# EAGLE schematic BAIT MicroMod Carrier Board (EAGLE 9.6.2)
Assembly variants: LoRa

## Sheet 1 of 2
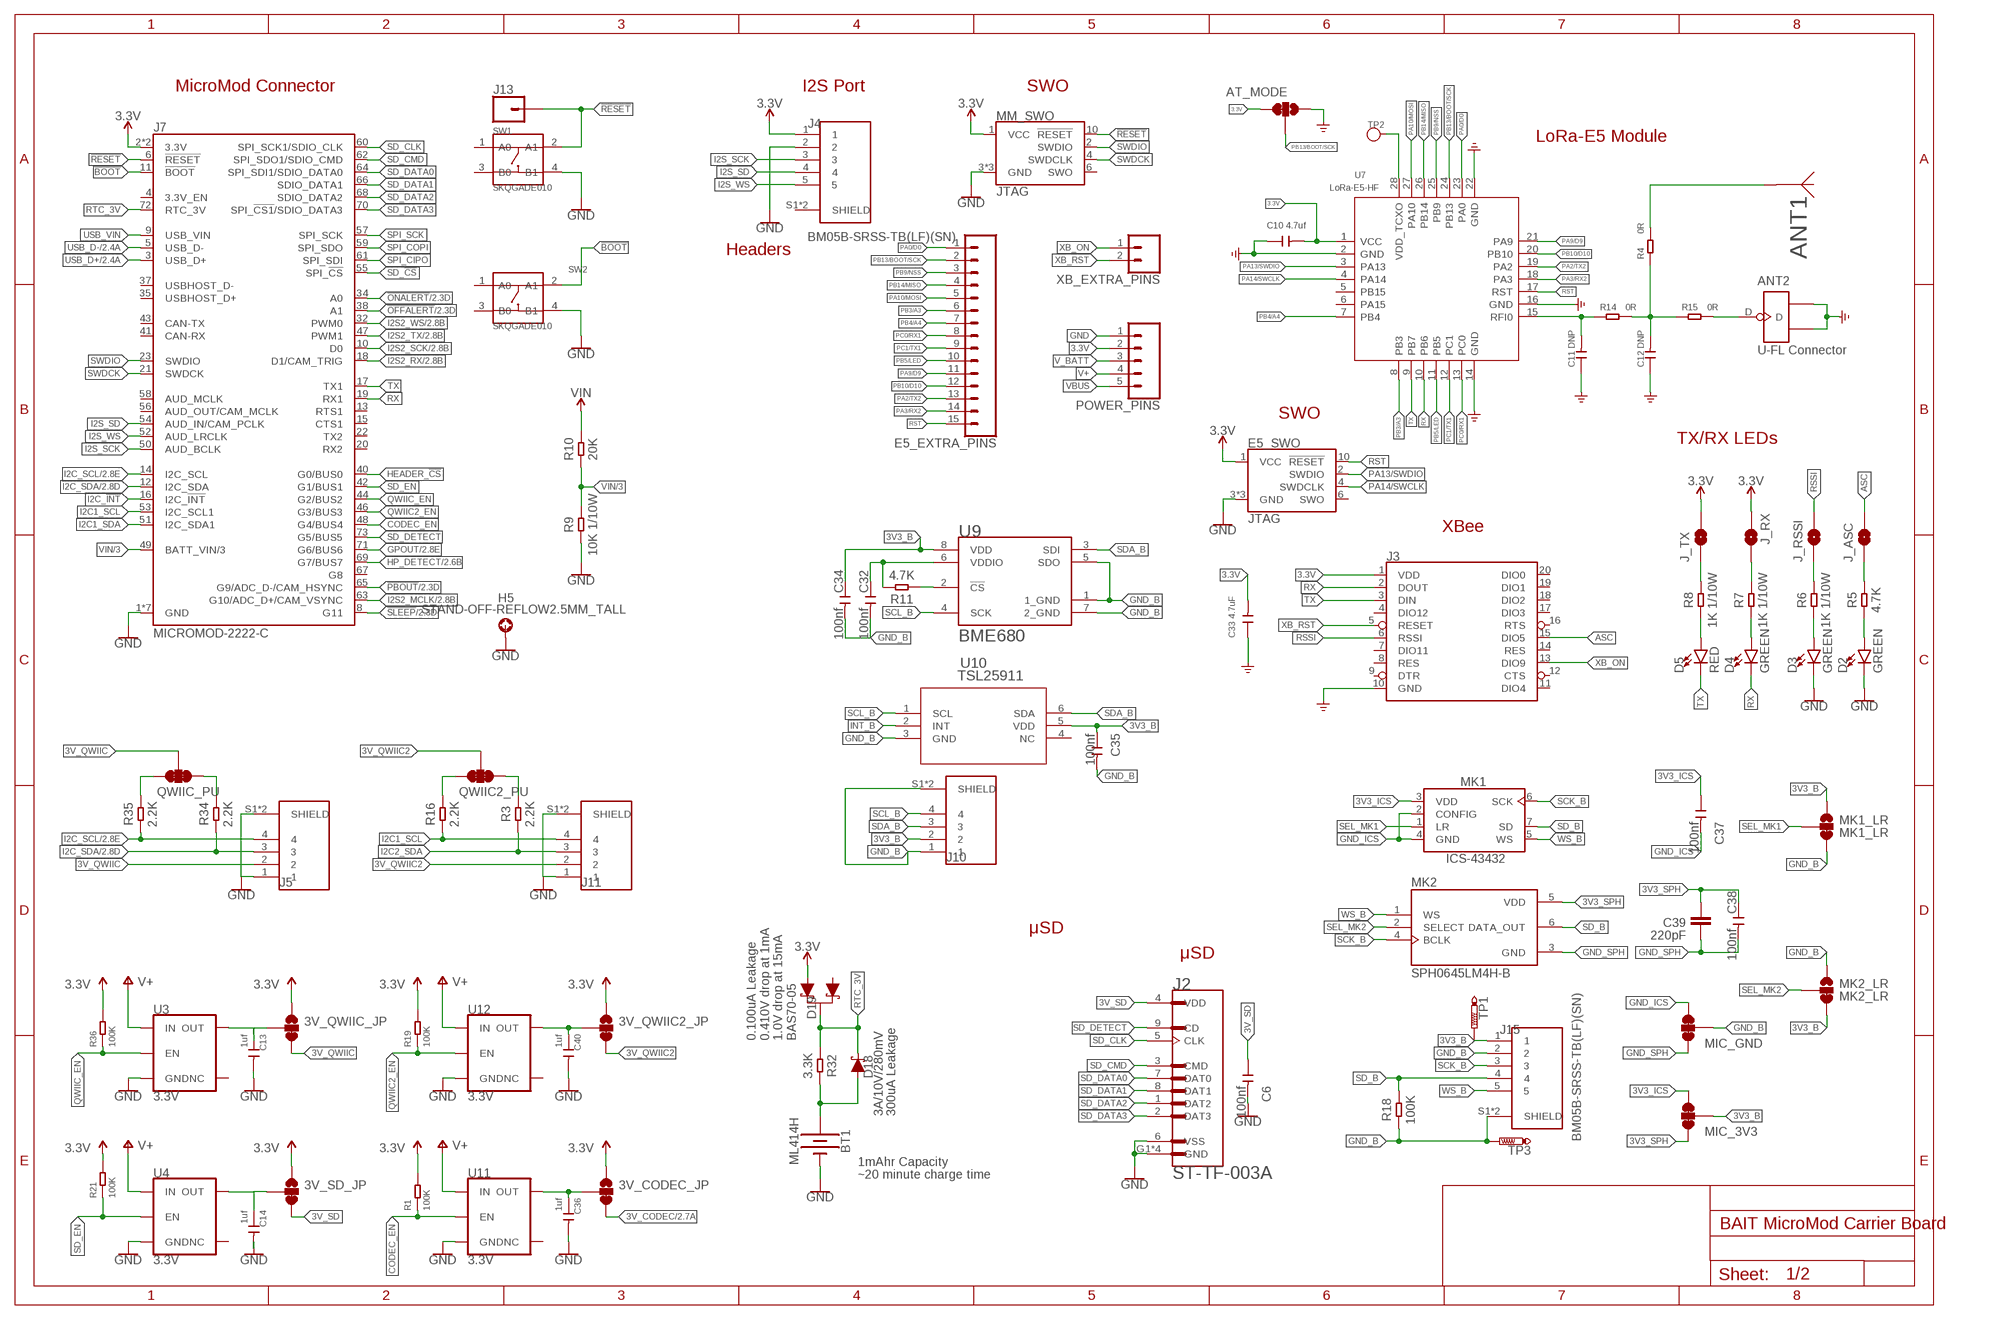
[diagram p0: schematic, sheet 1]

### Parts
3V_CODEC_JP  MK2_LR  JUMPER-SMT_3_1-NC_TRACE_SILK  [SMT-JUMPER_3_1-NC_TRACE_SILK]
3V_QWIIC2_JP  MK2_LR  JUMPER-SMT_3_1-NC_TRACE_SILK  [SMT-JUMPER_3_1-NC_TRACE_SILK]
3V_QWIIC_JP  MK2_LR  JUMPER-SMT_3_1-NC_TRACE_SILK  [SMT-JUMPER_3_1-NC_TRACE_SILK]
3V_SD_JP  MK2_LR  JUMPER-SMT_3_1-NC_TRACE_SILK  [SMT-JUMPER_3_1-NC_TRACE_SILK]
ANT1  0868AT43A0020EANT_0868AT43A0020E_JOT  [ANT_0868AT43A0020E_JOT]
ANT2  U-FL Connector  ANTENNA-U-FL-320110048  [U-FL3P-SMD-2.6X2.6X1.0MM]
AT_MODE  MK2_LR  JUMPER-SMT_3_1-NC_TRACE_SILK  [SMT-JUMPER_3_1-NC_TRACE_SILK]
BT1  ML414H  ML414H_IV01E_BATTERY  [ML414H_IV01E]
C6  100nf  CERAMIC-100NF-50V-10%-X7R(0603)  [C0603]
C10  4.7uf  CERAMIC-4.7UF-10V-10%-X5R(0603)  [C0603]
C11  DNP  CAP-0402  [C0402]
C12  DNP  CAP-0402  [C0402]
C13  1uf  CERAMIC-1UF-25V-10%-X7R(0603)  [C0603]
C14  1uf  CERAMIC-1UF-25V-10%-X7R(0603)  [C0603]
C32  100nf  CERAMIC-100NF-50V-10%-X7R(0603)  [C0603]
C33  4.7uF  CAP-0603  [C0603]
C34  100nf  CERAMIC-100NF-50V-10%-X7R(0603)  [C0603]
C35  100nf  CERAMIC-100NF-50V-10%-X7R(0603)  [C0603]
C36  1uf  CERAMIC-1UF-25V-10%-X7R(0603)  [C0603]
C37  100nf  CERAMIC-100NF-50V-10%-X7R(0603)  [C0603]
C38  100nf  CERAMIC-100NF-50V-10%-X7R(0603)  [C0603]
C39  220pF  C_CHIP-0603(1608-METRIC)  [CAPC1608X85]
C40  1uf  CERAMIC-1UF-25V-10%-X7R(0603)  [C0603]
D2  GREEN  LED-GREEN0603  [LED-0603]  (not fitted in variant LoRa)
D3  GREEN  LED-GREEN0603  [LED-0603]  (not fitted in variant LoRa)
D4  GREEN  LED-GREEN0603  [LED-0603]
D5  RED  LED-RED0603  [LED-0603]
D18  3A/10V/280mV  DIODE-SCHOTTKY-BAT60A  [SOD-323]
D19  BAS70-05  DIODE-SCHOTTKY-DUAL  [SOT23-3]
E5_EXTRA_PINS  CONN_15  [1X15]
E5_SWO  JTAG  CORTEX_JTAG_DEBUG_MINIMUM_PTH  [2X5-PTH-1.27MM]
H5  STAND-OFF-REFLOW2.5MM_TALL  [STAND-OFF-REFLOW-M2.5]
J2  ST-TF-003A  [SUNTECH_ST-TF-003A]
J3  XBEESMD  [XBEE-SMD]
J4  BM05B-SRSS-TB(LF)(SN)  [JST_BM05B-SRSS-TB(LF)(SN)]
J5  QWIIC_RIGHT_ANGLE  BM04B-SRSS-TB(LF)(SN)  [JST_BM04B-SRSS-TB(LF)(SN)]
J7  MICROMOD-2222-C  [M.2-CONNECTOR-E]
J10  QWIIC_RIGHT_ANGLE  BM04B-SRSS-TB(LF)(SN)  [JST_BM04B-SRSS-TB(LF)(SN)]
J11  QWIIC_RIGHT_ANGLE  BM04B-SRSS-TB(LF)(SN)  [JST_BM04B-SRSS-TB(LF)(SN)]
J13  CONN_01PTH_NO_SILK_YES_STOP  [1X01_NO_SILK]
J15  BM05B-SRSS-TB(LF)(SN)  [JST_BM05B-SRSS-TB(LF)(SN)]
J_ASC  JUMPER-SMT_2_NO_SILK  [SMT-JUMPER_2_NO_SILK]
J_RSSI  JUMPER-SMT_2_NO_SILK  [SMT-JUMPER_2_NO_SILK]
J_RX  JUMPER-SMT_2_NO_SILK  [SMT-JUMPER_2_NO_SILK]
J_TX  JUMPER-SMT_2_NO_SILK  [SMT-JUMPER_2_NO_SILK]
MIC_3V3  JUMPER-SMT_3_2-NC_TRACE_SILK  [SMT-JUMPER_3_2-NC_TRACE_SILK]
MIC_GND  JUMPER-SMT_3_2-NC_TRACE_SILK  [SMT-JUMPER_3_2-NC_TRACE_SILK]
MK1  ICS-43432  [ICS-43432]
MK1_LR  MK1_LR  JUMPER-SMT_3_1-NC_TRACE_SILK  [SMT-JUMPER_3_1-NC_TRACE_SILK]
MK2  SPH0645LM4H-B  [MIC_SPH0645LM4H-B]
MK2_LR  MK2_LR  JUMPER-SMT_3_1-NC_TRACE_SILK  [SMT-JUMPER_3_1-NC_TRACE_SILK]
MM_SWO  JTAG  CORTEX_JTAG_DEBUG_MINIMUM_PTH  [2X5-PTH-1.27MM]
POWER_PINS  CONN_05  [1X05]
QWIIC2_PU  JUMPER-SMT_3_2-NC_TRACE_SILK  [SMT-JUMPER_3_2-NC_TRACE_SILK]
QWIIC_PU  JUMPER-SMT_3_2-NC_TRACE_SILK  [SMT-JUMPER_3_2-NC_TRACE_SILK]
R1  100K  SMD-RES-100K-1%-1/10W(0603)  [R0603]
R3  2.2K  SMD-RES-2.2K-5%-1/10W(0603)  [R0603]
R4  0R  SMD-RES-0R-5%-1/10W(0603)  [R0603]
R5  4.7K  SMD-RES-4.7K-5%-1/10W(0603)  [R0603]  (not fitted in variant LoRa)
R6  1K 1/10W  SMD-RES-1K-5%-1/10W(0603)  [R0603]  (not fitted in variant LoRa)
R7  1K 1/10W  SMD-RES-1K-5%-1/10W(0603)  [R0603]
R8  1K 1/10W  SMD-RES-1K-5%-1/10W(0603)  [R0603]
R9  10K 1/10W  SMD-RES-10K-5%-1/10W(0603)  [R0603]
R10  20K  SMD-RES-20K-1%-1/10W(0603)  [R0603]
R11  4.7K  SMD-RES-4.7K-5%-1/10W(0603)  [R0603]
R14  0R  SMD-RES-0R-5%-1/10W(0603)  [R0603]
R15  0R  SMD-RES-0R-5%-1/10W(0603)  [R0603]
R16  2.2K  SMD-RES-2.2K-5%-1/10W(0603)  [R0603]
R18  100K  SMD-RES-100K-1%-1/10W(0603)  [R0603]
R19  100K  SMD-RES-100K-1%-1/10W(0603)  [R0603]
R21  100K  SMD-RES-100K-1%-1/10W(0603)  [R0603]
R32  3.3K  SMD-RES-3.3K-1%-1/10W(0603)  [R0603]
R34  2.2K  SMD-RES-2.2K-5%-1/10W(0603)  [R0603]
R35  2.2K  SMD-RES-2.2K-5%-1/10W(0603)  [R0603]
R36  100K  SMD-RES-100K-1%-1/10W(0603)  [R0603]
SW1  SKQGADE010  SMD-BUTTON(4P-5.2X5.2X1.5MM-SKQGADE010)-SKQGADE010  [SW4-SMD-5.2X5.2X1.5MM]
SW2  SKQGADE010  SMD-BUTTON(4P-5.2X5.2X1.5MM-SKQGADE010)-SKQGADE010  [SW4-SMD-5.2X5.2X1.5MM]
TP1  PTR1TP06R  [TP06R]
TP2  TEST  TEST-POINT'4545'  [TP-D45MIL]
TP3  PTR1TP06R  [TP06R]
U3  3.3V  V_REG_AP2112K-3.3V  [SOT23-5]
U4  3.3V  V_REG_AP2112K-3.3V  [SOT23-5]
U7  LoRa-E5-HF  MOUDLE_LORA_E5  [MOUDLE28P-1.25-12X12X2.5MM]
U9  BOSCH_TOOLS_BME680BOSCH_TOOLS_BME680_0_0  [BOSCH_TOOLS_BME680_0]
U10  TSL25911  TSL25911FNSON-06-FN_2000X2400_AMS  [SON-06-FN_2000X2400_AMS]
U11  3.3V  V_REG_AP2112K-3.3V  [SOT23-5]
U12  3.3V  V_REG_AP2112K-3.3V  [SOT23-5]
XB_EXTRA_PINS  CONN_02  [1X02]

### Nets
3.3V [power]: 3V_CODEC_JP.1 3V_QWIIC2_JP.1 3V_QWIIC_JP.1 3V_SD_JP.1 AT_MODE.3 C10.2 C33.2 D19.2(A1) E5_SWO.1(VCC) J3.1(VDD) J4.1 J7.2(3.3V) J7.74(3.3V) J_RX.1 J_TX.2 MM_SWO.1(VCC) POWER_PINS.2 R1.2 R19.2 R21.2 R36.2 U7.1(VCC) ; also sheet 2
3V3_B: C34.1 C35.1 J10.2 J15.1 MIC_3V3.2 MK1_LR.1 MK2_LR.3 TP1.TP U9.8(VDD) U10.5(VDD)
3V3_ICS: C37.1 MIC_3V3.3 MK1.3(VDD)
3V3_SPH: C38.1 C39.1 MIC_3V3.1 MK2.5(VDD)
3V_CODEC [power]: 3V_CODEC_JP.3 ; also sheet 2
3V_QWIIC [power]: 3V_QWIIC_JP.3 J5.2 QWIIC_PU.2
3V_QWIIC2 [power]: 3V_QWIIC2_JP.3 J11.2 QWIIC2_PU.2
3V_QWIIC_OUT [power]: 3V_QWIIC_JP.2 C13.1
3V_QWIIC_OUT1 [power]: 3V_CODEC_JP.2 C36.1 U11.5(OUT)
3V_QWIIC_OUT2 [power]: 3V_QWIIC2_JP.2 C40.1 U12.5(OUT)
3V_SD [power]: 3V_SD_JP.3 C6.1 J2.4(VDD)
3V_SD_OUT [power]: 3V_SD_JP.2 C14.1 U4.5(OUT)
!BOOT!: J7.11(!BOOT!) SW2.2(A1)
!OFFALERT!: J7.38(A1) ; also sheet 2
!ONALERT!: J7.34(A0) ; also sheet 2
!PBOUT!: J7.65(G9/ADC_D-/CAM_HSYNC) ; also sheet 2
!RESET!: J7.6(!RESET!) J13.1 MM_SWO.10(!RESET) SW1.2(A1)
!SLEEP!: J7.8(G11) ; also sheet 2
ASC: J3.15(DIO5) J_ASC.2
CODEC_EN: J7.48(G4/BUS4) R1.1 U11.3(EN)
GND [power]: ANT2.GND1 ANT2.GND2 AT_MODE.1 BT1.- C6.2 C10.1 C11.1 C12.1 C13.2 C14.2 C33.1 C36.2 C40.2 D2.C D3.C E5_SWO.3(GND) E5_SWO.5(GND) E5_SWO.9(GND) H5.1 J2.6(VSS) J2.G1(GND) J2.G2(GND) J2.G3(GND) J2.G4(GND) J3.10(GND) J4.2 J5.1 J5.S1(SHIELD) J5.S2(SHIELD) J7.1(GND) J7.7(GND) J7.33(GND) J7.36(GND) J7.39(GND) J7.45(GND) J7.75(GND) J11.1 J11.S1(SHIELD) J11.S2(SHIELD) MM_SWO.3(GND) MM_SWO.5(GND) MM_SWO.9(GND) POWER_PINS.1 R9.1 SW1.4(B1) SW2.4(B1) U3.2(GND) U4.2(GND) U7.2(GND) U7.14(GND) U7.16(GND) U7.22(GND) U11.2(GND) U12.2(GND) ; supply symbol labelled GND_POWER ; also sheet 2
GND_B: C32.2 C34.2 C35.2 J10.1 J10.S1(SHIELD) J10.S2(SHIELD) J15.2 J15.S1(SHIELD) J15.S2(SHIELD) MIC_GND.2 MK1_LR.3 MK2_LR.1 R18.1 TP3.TP U9.1(1_GND) U9.5(SDO) U9.7(2_GND) U10.3(GND)
GND_ICS: C37.2 MIC_GND.3 MK1.2(CONFIG) MK1.4(GND)
GND_SPH: C38.2 C39.2 MIC_GND.1 MK2.3(GND)
GPOUT: J7.71(G6/BUS6) ; also sheet 2
HEADER_!CS!: J7.40(G0/BUS0)
HP_DETECT: J7.69(G7/BUS7) ; also sheet 2
I2C1_SCL: J7.53(I2C_SCL1) J11.4 R16.1
I2C1_SDA: J7.51(I2C_SDA1)
I2C2_SDA: J11.3 R3.1
I2C_!INT!: J7.16(I2C_!INT!)
I2C_SCL [com]: J5.4 J7.14(I2C_SCL) R35.1 ; also sheet 2
I2C_SDA [com]: J5.3 J7.12(I2C_SDA) R34.1 ; also sheet 2
I2S2_MCLK: J7.63(G10/ADC_D+/CAM_VSYNC) ; also sheet 2
I2S2_RX: J7.18(D1/CAM_TRIG) ; also sheet 2
I2S2_SCK: J7.10(D0) ; also sheet 2
I2S2_TX: J7.47(PWM1) ; also sheet 2
I2S2_WS: J7.32(PWM0) ; also sheet 2
I2S_SCK: J4.3 J7.50(AUD_BCLK)
I2S_SD: J4.4 J7.54(AUD_IN/CAM_PCLK)
I2S_WS: J4.5 J7.52(AUD_LRCLK)
INT_B: U10.2(INT)
N$1: QWIIC2_PU.3 R16.2
N$2: QWIIC2_PU.1 R3.2
N$3: J_RX.2 R7.2
N$7 [impedence_ctl]: ANT2.D R15.2
N$9: D4.A R7.1
N$11 [impedence_ctl]: ANT1.1 R4.2
N$19: TP2.T U7.28(VDD_TCXO)
N$23: BT1.+ D18.A R32.1
N$24: QWIIC_PU.3 R35.2
N$25: J_ASC.1 R5.2
N$26: QWIIC_PU.1 R34.2
N$28 [impedence_ctl]: C12.2 R4.1 R14.2 R15.1
N$34: D2.A R5.1
N$42: J_RSSI.1 R6.2
N$43: D3.A R6.1
N$44: J_TX.1 R8.2
N$45: D5.A R8.1
N$54: C32.1 R11.2 U9.6(VDDIO)
N$55: R11.1 U9.2(!CS!)
N$77: U3.5(OUT)
PA0/D0: E5_EXTRA_PINS.1 U7.23(PA0)
PA2/TX2 [com]: E5_EXTRA_PINS.13 U7.19(PA2)
PA3/RX2 [com]: E5_EXTRA_PINS.14 U7.18(PA3)
PA9/D9: E5_EXTRA_PINS.11 U7.21(PA9)
PA10/MOSI [com]: E5_EXTRA_PINS.5 U7.27(PA10)
PA13/SWDIO: E5_SWO.2(SWDIO) U7.3(PA13)
PA14/SWCLK: E5_SWO.4(SWDCLK) U7.4(PA14)
PB3/A3: E5_EXTRA_PINS.6 U7.8(PB3)
PB4/A4: E5_EXTRA_PINS.7 U7.7(PB4)
PB5/LED: E5_EXTRA_PINS.10 U7.11(PB5)
PB9/NSS: E5_EXTRA_PINS.3 U7.25(PB9)
PB10/D10: E5_EXTRA_PINS.12 U7.20(PB10)
PB13/BOOT/SCK: AT_MODE.2 E5_EXTRA_PINS.2 U7.24(PB13)
PB14/MISO [com]: E5_EXTRA_PINS.4 U7.26(PB14)
PC0/RX1 [com]: E5_EXTRA_PINS.8 U7.13(PC0)
PC1/TX1 [com]: E5_EXTRA_PINS.9 U7.12(PC1)
QWIIC2_EN: J7.46(G3/BUS3) R19.1 U12.3(EN)
QWIIC_EN: J7.44(G2/BUS2) R36.1 U3.3(EN)
RF [impedence_ctl]: C11.2 R14.1 U7.15(RFI0)
RSSI: J3.6(RSSI) J_RSSI.2
RST: E5_EXTRA_PINS.15 E5_SWO.10(!RESET) U7.17(RST)
RTC_3V [power]: D18.C D19.3(C) J7.72(RTC_3V) R32.2
RX [com]: D4.C J3.2(DOUT) J7.19(RX1) U7.10(PB6)
SCK_B: J15.3 MK1.6(SCK) MK2.4(BCLK)
SCL_B: J10.4 U9.4(SCK) U10.1(SCL)
SD_!CS! [com]: J7.55(SPI_!CS!)
SD_B: J15.4 MK1.7(SD) MK2.6(DATA_OUT) R18.2
SD_CLK [com]: J2.5(CLK) J7.60(SPI_SCK1/SDIO_CLK)
SD_CMD [com]: J2.3(CMD) J7.62(SPI_SDO1/SDIO_CMD)
SD_DATA0 [com]: J2.7(DAT0) J7.64(SPI_SDI1/SDIO_DATA0)
SD_DATA1 [com]: J2.8(DAT1) J7.66(SDIO_DATA1)
SD_DATA2 [com]: J2.1(DAT2) J7.68(SDIO_DATA2)
SD_DATA3 [com]: J2.2(DAT3) J7.70(SPI_!CS1!/SDIO_DATA3)
SD_DETECT: J2.9(CD) J7.73(G5/BUS5)
SD_EN: J7.42(G1/BUS1) R21.1 U4.3(EN)
SDA_B: J10.3 U9.3(SDI) U10.6(SDA)
SEL_MK1: MK1.1(LR) MK1_LR.2
SEL_MK2: MK2.2(SELECT) MK2_LR.2
SPI_CIPO [com]: J7.61(SPI_SDI)
SPI_COPI [com]: J7.59(SPI_SDO)
SPI_SCK [com]: J7.57(SPI_SCK)
SWDCK: J7.21(SWDCK) MM_SWO.4(SWDCLK)
SWDIO: J7.23(SWDIO) MM_SWO.2(SWDIO)
TX [com]: D5.C J3.3(DIN) J7.17(TX1) U7.9(PB7)
USB_D+: J7.3(USB_D+) ; also sheet 2
USB_D-: J7.5(USB_D-) ; also sheet 2
USB_VIN [power]: J7.9(USB_VIN) ; also sheet 2
V+ [power]: POWER_PINS.4 U3.1(IN) U4.1(IN) U11.1(IN) U12.1(IN) ; also sheet 2
V_BATT [power]: POWER_PINS.3 ; also sheet 2
VBUS [power]: POWER_PINS.5 ; also sheet 2
VIN [power]: R10.2 ; also sheet 2
VIN/3 [power]: J7.49(BATT_VIN/3) R9.2 R10.1
WS_B: J15.5 MK1.5(WS) MK2.1(WS)
XB_ON [power]: J3.13(DIO9) XB_EXTRA_PINS.1
XB_RST [power]: J3.5(RESET) XB_EXTRA_PINS.2
Unconnected: D19.1(A) E5_SWO.6(SWO) J3.4(DIO12) J3.7(DIO11) J3.8(RES) J3.9(DTR) J3.11(DIO4) J3.12(CTS) J3.14(RES) J3.16(RTS) J3.17(DIO3) J3.18(DIO2) J3.19(DIO1) J3.20(DIO0) J4.S1(SHIELD) J4.S2(SHIELD) J7.4(3.3V_EN) J7.13(RTS1) J7.15(CTS1) J7.20(RX2) J7.22(TX2) J7.35(USBHOST_D+) J7.37(USBHOST_D-) J7.41(CAN-RX) J7.43(CAN-TX) J7.56(AUD_OUT/CAM_MCLK) J7.58(AUD_MCLK) J7.67(G8) MM_SWO.6(SWO) SW1.1(A0) SW1.3(B0) SW2.1(A0) SW2.3(B0) U3.4(NC) U4.4(NC) U7.5(PB15) U7.6(PA15) U10.4(NC) U11.4(NC) U12.4(NC)

### Notes on the sheet
- MicroMod Connector | I2S Port | SWO
- LoRa-E5 Module
- Headers
- SWO
- TX/RX LEDs
- XBee
- μSD
- μSD
- 0.100uA Leakage
  0.410V drop at 1mA
  1.0V drop at 15mA
- 300uA Leakage
- 1mAhr Capacity
- ~20 minute charge time

## Sheet 2 of 2
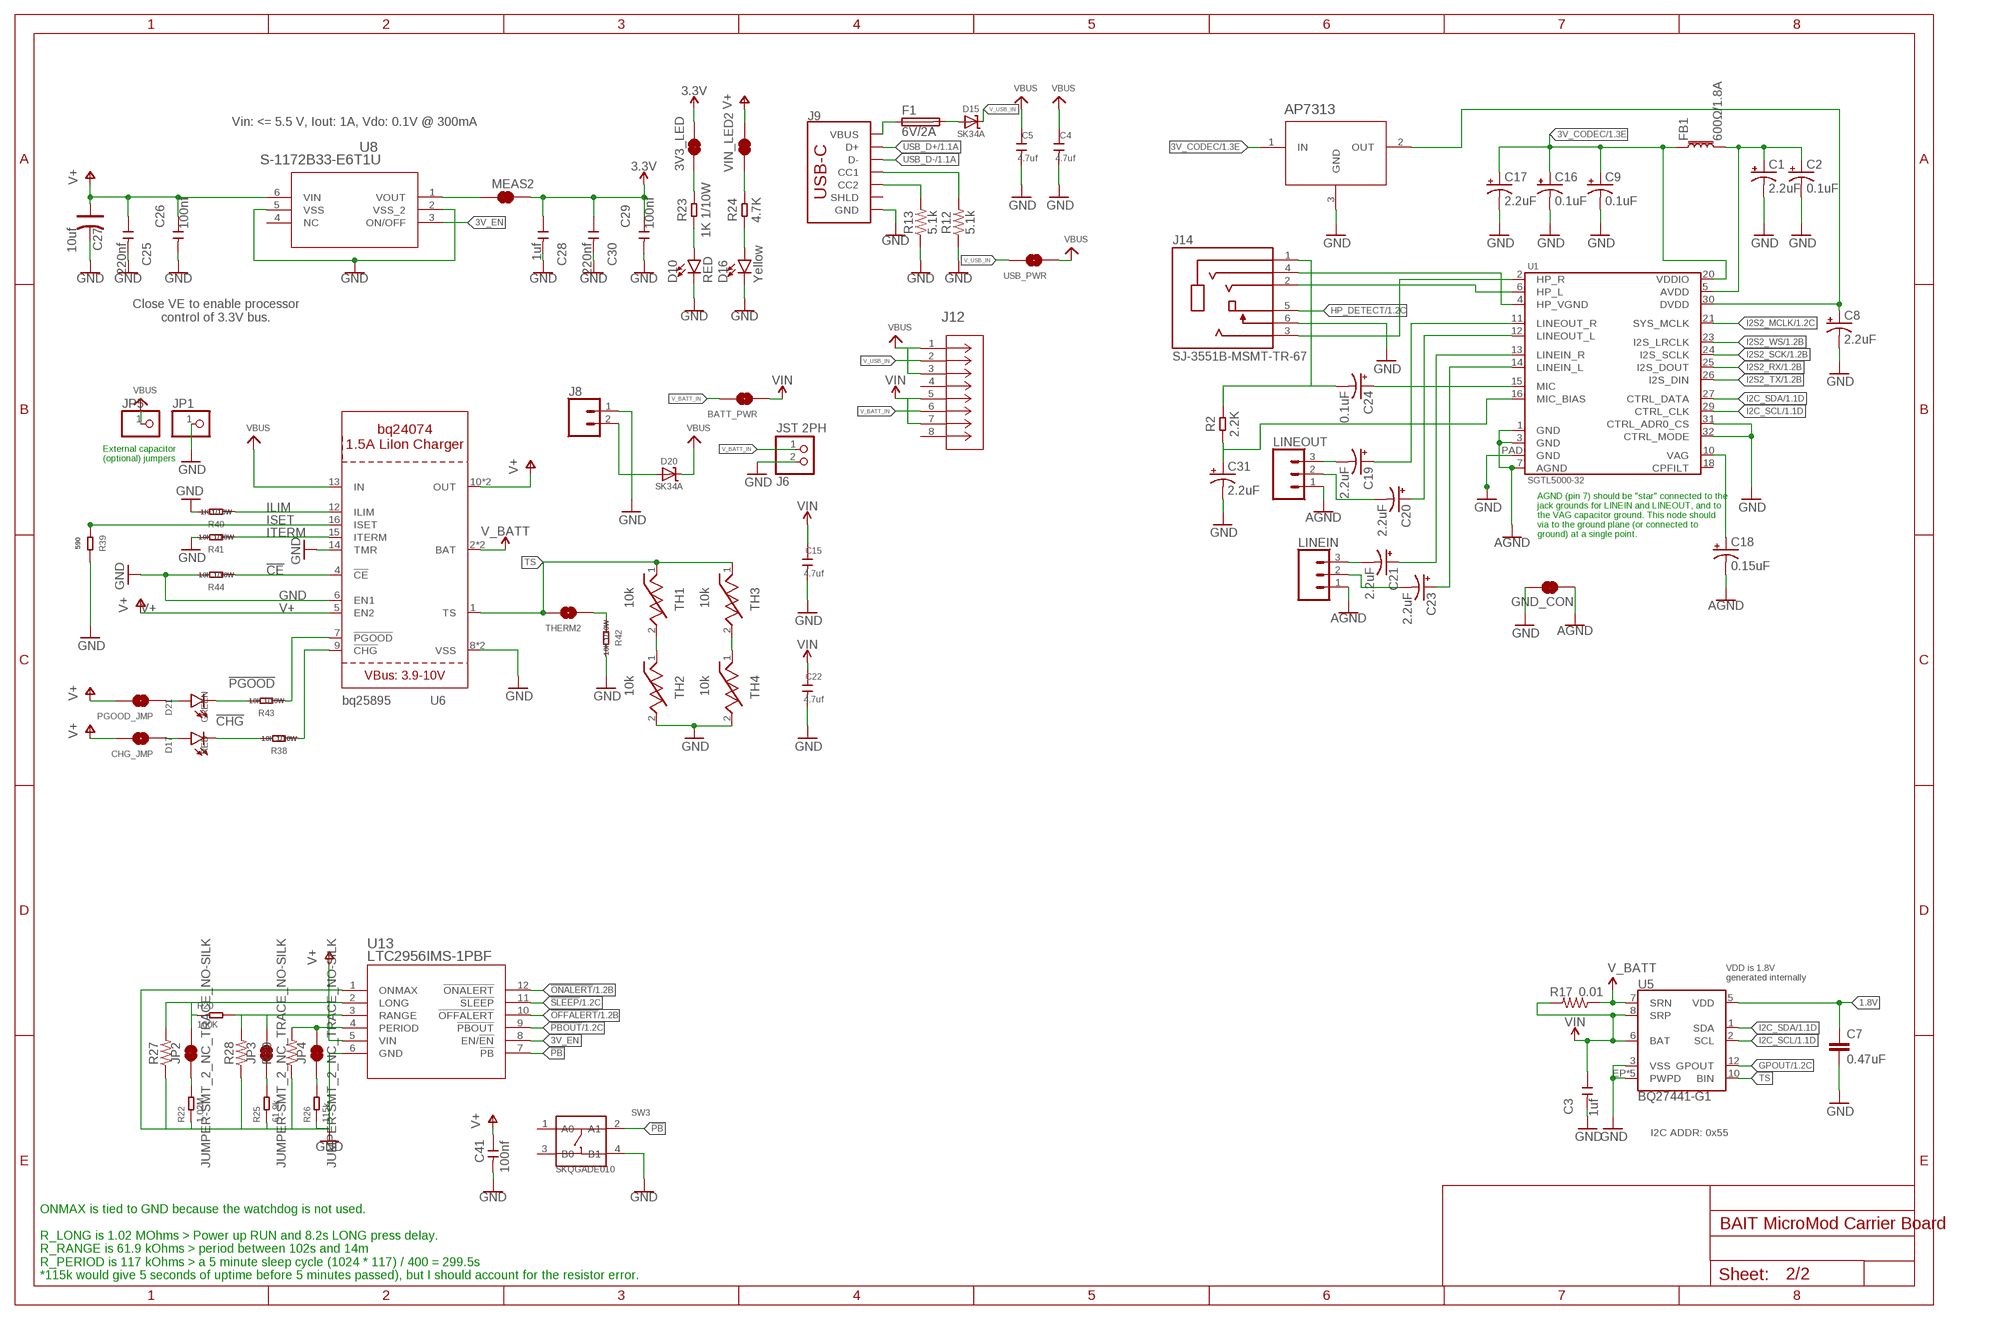
[diagram p1: schematic, sheet 2]

### Parts
3V3_LED  JUMPER-SMT_2_NC_TRACE_SILK  [SMT-JUMPER_2_NC_TRACE_SILK]
BATT_PWR  JUMPER-SMT_2_NO_NO-SILK  [SMT-JUMPER_2_NO_NO-SILK]
C1  2.2uF  10UF-POLAR-0603-6.3V-20%(TANT)  [0603-POLAR]
C2  0.1uF  10UF-POLAR-EIA3216-16V-10%(TANT)  [EIA3216]
C3  1uf  CERAMIC-1UF-25V-10%-X7R(0603)  [C0603]
C4  4.7uf  CERAMIC-4.7UF-10V-10%-X5R(0603)  [C0603]
C5  4.7uf  CERAMIC-4.7UF-10V-10%-X5R(0603)  [C0603]
C7  0.47uF  CAP0603-CAP  [0603-CAP]
C8  2.2uF  10UF-POLAR-0603-6.3V-20%(TANT)  [0603-POLAR]
C9  0.1uF  10UF-POLAR-EIA3216-16V-10%(TANT)  [EIA3216]
C15  4.7uf  CERAMIC-4.7UF-10V-10%-X5R(0603)  [C0603]
C16  0.1uF  10UF-POLAR-EIA3216-16V-10%(TANT)  [EIA3216]
C17  2.2uF  10UF-POLAR-0603-6.3V-20%(TANT)  [0603-POLAR]
C18  0.15uF  10UF-POLAR-EIA3216-16V-10%(TANT)  [EIA3216]
C19  2.2uF  10UF-POLAR-0603-6.3V-20%(TANT)  [0603-POLAR]
C20  2.2uF  10UF-POLAR-0603-6.3V-20%(TANT)  [0603-POLAR]
C21  2.2uF  10UF-POLAR-0603-6.3V-20%(TANT)  [0603-POLAR]
C22  4.7uf  CERAMIC-4.7UF-10V-10%-X5R(0603)  [C0603]
C23  2.2uF  10UF-POLAR-0603-6.3V-20%(TANT)  [0603-POLAR]
C24  0.1uF  10UF-POLAR-EIA3216-16V-10%(TANT)  [EIA3216]
C25  220nf  CERAMIC-220NF-25V-10%-X7R(0603)  [C0603]
C26  100nf  CERAMIC-100NF-50V-10%-X7R(0603)  [C0603]
C27  10uf  TANTALUM-SMD-10UF-16V-10%(AVX-A)  [AVX-A]
C28  1uf  CERAMIC-1UF-25V-10%-X7R(0603)  [C0603]
C29  100nf  CERAMIC-100NF-50V-10%-X7R(0603)  [C0603]
C30  220nf  CERAMIC-220NF-25V-10%-X7R(0603)  [C0603]
C31  2.2uF  10UF-POLAR-0603-6.3V-20%(TANT)  [0603-POLAR]
C41  100nf  CERAMIC-100NF-50V-10%-X7R(0603)  [C0603]
CHG_JMP  JUMPER-SMT_2_NO_NO-SILK  [SMT-JUMPER_2_NO_NO-SILK]
D10  RED  LED-RED0603  [LED-0603]
D15  SK34A  DIODE-SCHOTTKYSMA  [SMADIODE]
D16  Yellow  LED-YELLOW0603  [LED-0603]
D17  RED  LED-RED0603  [LED-0603]
D20  SK34A  DIODE-SCHOTTKYSMA  [SMADIODE]
D21  GREEN  LED-GREEN0603  [LED-0603]
F1  6V/2A  FUSE_CHIP-1206(3216-METRIC)  [FUSC3215X82N]
FB1  600Ω/1.8A  FERRITE_BEAD-0603  [0603]
GND_CON  JUMPER-SMT_2_NC_TRACE_SILK  [SMT-JUMPER_2_NC_TRACE_SILK]
J6  JST 2PH  JST_2PIN-SMT-RA  [JST-PH-2-SMT-RA]
J8  CONN_02-JST-2MM-SMT  [JST-2-SMD]
J9  USB_C_2-LAYER_PADS  [USB-C-16P-2LAYER-PADS]
J12  L203011MS02QECONN8_MS02QE_CNK  [CONN8_MS02QE_CNK]
J14  SJ-3551B-MSMT-TR-67  [CUI_SJ-3551B-MSMT-TR-67]
JP1  HEADER-1X1  [1X01_OVAL]
JP2  JUMPER-SMT_2_NC_TRACE_NO-SILK  [SMT-JUMPER_2_NC_TRACE_NO-SILK]
JP3  JUMPER-SMT_2_NC_TRACE_NO-SILK  [SMT-JUMPER_2_NC_TRACE_NO-SILK]
JP4  JUMPER-SMT_2_NC_TRACE_NO-SILK  [SMT-JUMPER_2_NC_TRACE_NO-SILK]
JP5  HEADER-1X1  [1X01_OVAL]
LINEIN  CONN_03  [1X03]
LINEOUT  CONN_03  [1X03]
MEAS2  JUMPER-COMBO_2_NC_TRACE  [COMBO-JUMPER_2_NC_TRACE]
PGOOD_JMP  JUMPER-SMT_2_NO_NO-SILK  [SMT-JUMPER_2_NO_NO-SILK]
R2  2.2K  SMD-RES-2.2K-5%-1/10W(0603)  [R0603]
R12  5.1k  5.1KOHM5.1KOHM-0603-1/10W-1%  [0603]
R13  5.1k  5.1KOHM5.1KOHM-0603-1/10W-1%  [0603]
R17  0.01  RESISTOR1206  [1206]
R20  100K  SMD-RES-100K-1%-1/10W(0603)  [R0603]
R22  1.02M  SMD-RES-100K-1%-1/10W(0603)  [R0603]
R23  1K 1/10W  SMD-RES-1K-5%-1/10W(0603)  [R0603]
R24  4.7K  SMD-RES-4.7K-5%-1/10W(0603)  [R0603]
R25  61.9k  SMD-RES-100K-1%-1/10W(0603)  [R0603]
R26  115k  SMD-RES-100K-1%-1/10W(0603)  [R0603]
R27  RESISTORAXIAL-0.3  [AXIAL-0.3]
R28  RESISTORAXIAL-0.3  [AXIAL-0.3]
R29  RESISTORAXIAL-0.3  [AXIAL-0.3]
R38  10K 1/10W  SMD-RES-10K-5%-1/10W(0603)  [R0603]
R39  590  SMD-RES-560R-5%-1/10W(0603)  [R0603]
R40  1K 1/10W  SMD-RES-1K-5%-1/10W(0603)  [R0603]
R41  10K 1/10W  SMD-RES-10K-5%-1/10W(0603)  [R0603]
R42  10K 1/10W  SMD-RES-10K-5%-1/10W(0603)  [R0603]
R43  10K 1/10W  SMD-RES-10K-5%-1/10W(0603)  [R0603]
R44  10K 1/10W  SMD-RES-10K-5%-1/10W(0603)  [R0603]
SW3  SKQGADE010  SMD-BUTTON(4P-5.2X5.2X1.5MM-SKQGADE010)-SKQGADE010  [SW4-SMD-5.2X5.2X1.5MM]
TH1  10k  NTCG163JX103DT1S  [THERM_NTCG163JX103DT1S]
TH2  10k  NTCG163JX103DT1S  [THERM_NTCG163JX103DT1S]
TH3  10k  NTCG163JX103DT1S  [THERM_NTCG163JX103DT1S]
TH4  10k  NTCG163JX103DT1S  [THERM_NTCG163JX103DT1S]
THERM2  JUMPER-SMT_2_NO_NO-SILK  [SMT-JUMPER_2_NO_NO-SILK]
U1  SGTL5000-32  [QFN-32-5MM]
U2  AP7313  [SOT-23_DIO]
U5  BQ27441-G1  [PDSO-N12]
U6  BQ24074  [QFN16_3MM]
U8  S-1172B33-E6T1U  [HSOP-6_FH006-A-P-SD-2.1_ABL]
U13  LTC2956IMS-1PBF  [MSOP-12_MS_LIT]
USB_PWR  JUMPER-SMT_2_NO_NO-SILK  [SMT-JUMPER_2_NO_NO-SILK]
VIN_LED2  JUMPER-SMT_2_NC_TRACE_SILK  [SMT-JUMPER_2_NC_TRACE_SILK]

### Nets
1.8V [power]: C7.1 U5.5(VDD)
3.3V [power]: 3V3_LED.2 C28.1 C29.1 C30.1 MEAS2.2 MEAS2.4 ; also sheet 1
3V_CODEC [power]: C9.+ C16.+ C17.+ FB1.1 U1.20(VDDIO) U2.1(IN) ; also sheet 1
3V_EN [power]: U8.3(ON/OFF) U13.8(EN/!EN)
!CE: R44.1 U6.4(!CE)
!CHG: R38.1 U6.9(!CHG)
!OFFALERT!: U13.10(!OFFALERT) ; also sheet 1
!ONALERT!: U13.12(!ONALERT) ; also sheet 1
!PB: SW3.2(A1) U13.7(!PB)
!PBOUT!: U13.9(!PBOUT) ; also sheet 1
!PGOOD: R43.1 U6.7(!PGOOD)
!SLEEP!: U13.11(!SLEEP) ; also sheet 1
AGND: C18.- GND_CON.1 LINEIN.1 LINEOUT.1 U1.1(GND) U1.3(GND) U1.7(AGND)
GND [power]: C1.- C2.- C3.2 C4.2 C5.2 C7.2 C8.- C9.- C15.2 C16.- C17.- C22.2 C25.2 C26.2 C27.- C28.2 C29.2 C30.2 C31.- C41.2 D10.C D16.C GND_CON.2 J6.2 J8.1 J9.GND J9.GND2(GND) J14.6 JP1.1 R12.1 R13.1 R22.1 R25.1 R26.1 R27.P$1 R28.P$1 R29.P$1 R39.2 R40.2 R41.2 R42.2 R44.2 SW3.4(B1) TH2.2 TH4.2 U1.31(CTRL_ADR0_CS) U1.32(CTRL_MODE) U1.PAD(GND) U2.3(GND) U5.3(VSS) U5.EP1(PWPD) U5.EP2(PWPD) U5.EP3(PWPD) U5.EP4(PWPD) U5.EP(PWPD) U6.6(EN1) U6.8(VSS) U6.14(TMR) U6.THERMAL(VSS) U8.2(VSS_2) U8.5(VSS) U13.1(ONMAX) U13.6(GND) ; also sheet 1
GPOUT: U5.12(GPOUT) ; also sheet 1
HP_DETECT: J14.5 ; also sheet 1
I2C_SCL [com]: U1.29(CTRL_CLK) U5.2(SCL) ; also sheet 1
I2C_SDA [com]: U1.27(CTRL_DATA) U5.1(SDA) ; also sheet 1
I2S2_MCLK: U1.21(SYS_MCLK) ; also sheet 1
I2S2_RX: U1.25(I2S_DOUT) ; also sheet 1
I2S2_SCK: U1.24(I2S_SCLK) ; also sheet 1
I2S2_TX: U1.26(I2S_DIN) ; also sheet 1
I2S2_WS: U1.23(I2S_LRCLK) ; also sheet 1
ILIM: R40.1 U6.12(ILIM)
ISET: R39.1 U6.16(ISET)
ITERM: R41.1 U6.15(ITERM)
N$4: J9.A5(CC1) R12.2
N$5: J9.B5(CC2) R13.2
N$6: MEAS2.1 MEAS2.3 U8.1(VOUT)
N$8: J14.2 U1.6(HP_L)
N$10: R42.1 THERM2.1
N$13: C19.- LINEOUT.3
N$14: C20.- LINEOUT.2
N$15: C21.- LINEIN.3
N$16: 3V3_LED.1 R23.2
N$17: C23.- LINEIN.2
N$18: C19.+ U1.11(LINEOUT_R)
N$20: C20.+ U1.12(LINEOUT_L)
N$21: C21.+ U1.13(LINEIN_R)
N$22: C23.+ U1.14(LINEIN_L)
N$27: D10.A R23.1
N$29: R24.2 VIN_LED2.1
N$30: D20.A J8.2
N$31: D17.C R38.2
N$32: D21.C R43.2
N$33: C24.- J14.1 R2.2
N$35: J14.3 U1.2(HP_R)
N$36: F1.1 J9.VBUS1(VBUS) J9.VBUS2(VBUS)
N$37: D16.A R24.1
N$38: C18.+ U1.10(VAG)
N$40: C24.+ U1.15(MIC)
N$41: C8.+ U1.30(DVDD) U2.2(OUT)
N$46: C1.+ C2.+ FB1.2 U1.5(AVDD)
N$48: J14.4 U1.4(HP_VGND)
N$49: TH3.2 TH4.1
N$50: TH1.2 TH2.1
N$75: D21.A PGOOD_JMP.1
N$76: CHG_JMP.1 D17.A
N$78: JP3.2 R20.2 R28.P$2 U13.3(RANGE)
N$79: JP2.1 R22.2
N$80: JP4.2 R29.P$2 U13.4(PERIOD)
N$81: JP2.2 R20.1 R27.P$2 U13.2(LONG)
N$82: JP3.1 R25.2
N$83: JP4.1 R26.2
N$84: C31.+ R2.1 U1.16(MIC_BIAS)
TS: TH1.1 TH3.1 THERM2.2 U5.10(BIN) U6.1(TS)
USB_D+: J9.A6(D+) J9.B6(D+) ; also sheet 1
USB_D-: J9.A7(D-) J9.B7(D-) ; also sheet 1
USB_VIN [power]: D15.A F1.2 ; also sheet 1
V+ [power]: C25.1 C26.1 C27.+ C41.1 CHG_JMP.2 PGOOD_JMP.2 U6.5(EN2) U6.10(OUT) U6.11(OUT) U8.6(VIN) U13.5(VIN) VIN_LED2.2 ; also sheet 1
V_BATT [power]: R17.1 U5.7(SRN) U6.2(BAT) U6.3(BAT) ; also sheet 1
V_BATT_IN [power]: BATT_PWR.2 J6.1 J12.6
V_USB_IN [power]: D15.C J12.2 USB_PWR.2
VBUS [power]: C4.1 C5.1 D20.C J12.1 J12.3 JP5.1 U6.13(IN) USB_PWR.1 ; also sheet 1
VIN [power]: BATT_PWR.1 C3.1 C15.1 C22.1 J12.5 J12.7 R17.2 U5.6(BAT) U5.8(SRP) ; also sheet 1
Unconnected: J9.SHLD1(SHLD) J9.SHLD2(SHLD) J9.SHLD3(SHLD) J9.SHLD4(SHLD) J12.4 J12.8 SW3.1(A0) SW3.3(B0) U1.18(CPFILT) U8.4(NC)

### Notes on the sheet
- Vin: <= 5.5 V, Iout: 1A, Vdo: 0.1V @ 300mA
- Close VE to enable processor
  control of 3.3V bus.
- External capacitor
  (optional) jumpers
- AGND (pin 7) should be "star" connected to the
  jack grounds for LINEIN and LINEOUT, and to
  the VAG capacitor ground. This node should
  via to the ground plane (or connected to
  ground) at a single point.
- VDD is 1.8V
  generated internally
- I2C ADDR: 0x55
- ONMAX is tied to GND because the watchdog is not used.
  
  R_LONG is 1.02 MOhms > Power up RUN and 8.2s LONG press delay.
  R_RANGE is 61.9 kOhms > period between 102s and 14m
  R_PERIOD is 117 kOhms > a 5 minute sleep cycle (1024 * 117) / 400 = 299.5s
  *115k would give 5 seconds of uptime before 5 minutes passed), but I should account for the resistor error.

## Library data of the parts
3V3_LED GND_CON JP2-JP4 VIN_LED2 = SparkFun-Jumpers:JUMPER-SMT_2_NC_TRACE: Normally closed trace jumper This jumper has a trace between two pads so it's normally closed (NC). Use a razor knife to open the connection. For best results follow the IPC guidelines for cutting traces: Cutout at least 0.063 mm (0.005 in). Remove all loose material to clean up the cut area. Seal the cut with an approved epoxy. Reapply solder to reclose the connection.
3V_CODEC_JP 3V_QWIIC2_JP 3V_QWIIC_JP 3V_SD_JP AT_MODE MK1_LR MK2_LR = SparkFun-Jumpers:JUMPER-SMT_3_1-NC_TRACE: Normally closed trace jumper (1 of 2 connections) This jumper has a trace between two pads so it's normally closed (NC). The other connection is normally open (NO). Use a razor knife to open the connection. For best results follow the IPC guidelines for cutting traces: Cutout at least 0.063 mm (0.005 in). Remove all loose material to clean up the cut area. Seal the cut with an approved epoxy. Reapply solder to reclose the connection, or to close the NO connection.
ANT1 = 2023-01-04_20-35-52_Library:0868AT43A0020E; COPYRIGHT: Copyright (C) 2023 Ultra Librarian. All rights reserved.; MANUFACTURER_PART_NUMBER: 0868AT43A0020E; MFR_NAME: Johanson Technology
ANT2 = Connector-new:ANTENNA-U-FL
BATT_PWR CHG_JMP J_ASC J_RSSI J_RX J_TX PGOOD_JMP THERM2 USB_PWR = SparkFun-Jumpers:JUMPER-SMT_2_NO: Normally open jumper This jumper has two pads in close proximity to each other. Apply solder to close the connection. Round pads are easier to solder for beginners, but are a lot larger. SparkFun Product that uses the round pads: SparkFun EL Sequencer <https://www.sparkfun.com/products/12781>
BT1 = SparkFun-Batteries:ML414H_IV01E_BATTERY: SEIKO ML414H-IV01E Reflowable Lithium Battery ML414H is a rechargeable, coin type battery with features such as Pb-free reflowable (Peak temperature: 260 C) and high temperature heat resistance. Battery Characteristics: 3.1V max voltage Voff is 2V 1mAH 3k series resistor with battery 72 hour charge time from 2.0-3.1V 2.3-2.8V initial charge; MPN: ML414H-IV01E; PROD_ID: BATT-14267
C1 C8 C17 C19-C21 C23 C31 = SparkFun-Capacitors:10UF-POLAR: 10.0µF polarized capacitors A capacitor is a passive two-terminal electrical component used to store electrical energy temporarily in an electric field.; MPN: S2B-PH-SM4-TB(LF)(SN); PROD_ID: CAP-13210; VALUE: 10uF
C2 C9 C16 C24 = SparkFun-Capacitors:10UF-POLAR: 10.0µF polarized capacitors A capacitor is a passive two-terminal electrical component used to store electrical energy temporarily in an electric field.; MPN: T491A104M035AT; PROD_ID: CAP-00811; VALUE: 10uF
C3 C13 C14 C28 C36 C40 = OPL_Capacitor:CERAMIC-1UF-25V-10%-X7R(0603): 302010139; MPN: CC0603KRX7R8BB105
C4 C5 C10 C15 C22 = OPL_Capacitor:CERAMIC-4.7UF-10V-10%-X5R(0603): 302010111; MPN: CC0603KRX5R6BB475
C6 C26 C29 C38 C41 = OPL_Capacitor:CERAMIC-100NF-50V-10%-X7R(0603): 302010138; MPN: CC0603KRX7R9BB104
C7 = SparkFun-Capacitors:CAP: Capacitor Standard 0603 ceramic capacitor, and 0.1" leaded capacitor.; MPN: TACL474K010XTA; PROD_ID: CAP-13216
C11 C12 = Discrete-new:CAP: Ceramic Capacitors
C18 = SparkFun-Capacitors:10UF-POLAR: 10.0µF polarized capacitors A capacitor is a passive two-terminal electrical component used to store electrical energy temporarily in an electric field.; MPN: T491A154K035AT; PROD_ID: CAP-00811; VALUE: 10uF
C25 C30 = OPL_Capacitor:CERAMIC-220NF-25V-10%-X7R(0603): 302010073; MPN: CC0603KRX7R8BB224
C27 = OPL_Capacitor:TANTALUM-SMD-10UF-16V-10%(AVX-A): 302020002; MPN: TAJA106K016RNJ
C32 C34 C35 C37 = OPL_Capacitor:CERAMIC-100NF-50V-10%-X7R(0603): 302010138; MPN: 06033G104ZAT2A; PROD_ID: CAP-13216
C33 = Discrete-new:CAP: Ceramic Capacitors; MPN: TMCJ0J475MTRF
C39 = Capacitor:C: Capacitor - Generic; CATEGORY: Capacitor; MPN: C1608C0G1H221J080AA
D2-D4 = SparkFun-LED:LED-GREEN: Green SMD LED Used in manufacturing of various products at SparkFun Packages: 0603 - SMD 0603 package [Product Link] <http://www.futureelectronics.com/en/technologies/semiconductors/optoelectronics/leds/Pages/9894312-LTST-C190GKT.aspx?CrossPart=HSMG-C190&IM=0> LilyPad 1206 - SMD1206 LilyPad package [Product Link] <http://www.futureelectronics.com/en/Technologies/Product.aspx?ProductID=IN150NGHARVATEKCORPORATION2049943&IM=0> 1206 - SMD1206 package [Product Link] <http://www.futureelectronics.com/en/technologies/semiconductors/optoelectronics/leds/Pages/8315665-LTST-C150KGKT.aspx?IM=0> 1206 Bottom Mount -SMD 1206 Bottom Mount [Product Link] <http://www.digikey.com/product-detail/en/lite-on-inc/LTST-C230KGKT/160-1456-1-ND/386854> SparkFun Products: Pro Mini 328 -5V <https://www.sparkfun.com/products/821> RedBoard <https://www.sparkfun.com/products/12757> MP3 Trigger <https://www.sparkfun.com/products/13720> Makey Makey <https://www.sparkfun.com/products/11076>; MPN: LTST-S270GKT; PROD_ID: DIO-00821
D5 = SparkFun-LED:LED-RED: Red SMD LED Used in manufacturing of most products at SparkFun Packages: 0603 - SMD 0603 package [Product Link] <http://docs.avagotech.com/docs/AV02-0551EN> 0603 SMART - SMD 0603 SMART package ( more efficient and expensive)[Product Link] <http://www.osram-os.com/Graphics/XPic2/00077099_0.pdf> 1206 - SMD1206 package [Product Link] <https://www.sparkfun.com/datasheets/DevTools/LilyPad/Q150OVS4.pdff> SparkFun Products: Pro Mini 328 -5V <https://www.sparkfun.com/products/821> RedBoard <https://www.sparkfun.com/products/12757> IOIO-OTG <https://www.sparkfun.com/products/13613>; MPN: LTST-S270EKT; PROD_ID: DIO-00819
D10 D17 = SparkFun-LED:LED-RED: Red SMD LED Used in manufacturing of most products at SparkFun Packages: 0603 - SMD 0603 package [Product Link] <http://docs.avagotech.com/docs/AV02-0551EN> 0603 SMART - SMD 0603 SMART package ( more efficient and expensive)[Product Link] <http://www.osram-os.com/Graphics/XPic2/00077099_0.pdf> 1206 - SMD1206 package [Product Link] <https://www.sparkfun.com/datasheets/DevTools/LilyPad/Q150OVS4.pdff> SparkFun Products: Pro Mini 328 -5V <https://www.sparkfun.com/products/821> RedBoard <https://www.sparkfun.com/products/12757> IOIO-OTG <https://www.sparkfun.com/products/13613>; PROD_ID: DIO-00819
D15 D20 = microbuilder:DIODE-SCHOTTKY; MPN: SK34A-LTP
D16 = SparkFun-LED:LED-YELLOW: Yellow SMD LED Used in manufacturing several products at SparkFun. Packages: 0603 - SMD 0603 package[Product Link] <http://www.kingbrightusa.com/product.asp?catalog_name=LED&product_id=APT1608SYCK> 0603 -SMART - SMART SMD 0603 package (more efficient/more expensive) [Product Link] <http://www.osram-os.com/osram_os/en/products/product-catalog/led-light-emitting-diodes/smartled-0603/ly-l29k/index.jsp> LilyPad - SMD1206 package[Product Datasheet] <https://www.sparkfun.com/datasheets/DevTools/LilyPad/Q150YUS4.pdf> SparkFun Products: Blynk Board <https://www.sparkfun.com/products/13794> IOIO-OTG <https://www.sparkfun.com/products/13613> XBee Explorer Serial <https://www.sparkfun.com/products/13225>; MPN: LTST-S270KSKT; PROD_ID: DIO-09003
D18 = SparkFun-DiscreteSemi:DIODE-SCHOTTKY: Schottky diode A Schottky diode is a semiconductor diode which has a low forward voltage drop and a very fast switching action.; MPN: BAT60AE6327HTSA1; PROD_ID: DIO-14072
D19 = SparkFun-DiscreteSemi:DIODE-SCHOTTKY-DUAL: Diodes Incorporated - BAS70-05 Dual Schottky Diode Two Schottky Diodes in a single SOT-23 package. Low reverse current (100 nA) Vf: Datasheet referenced for footprint <https://www.diodes.com/assets/Datasheets/ds11007.pdf>; MPN: BAS70-05-7-F; PROD_ID: DIO-14829
D21 = SparkFun-LED:LED-GREEN: Green SMD LED Used in manufacturing of various products at SparkFun Packages: 0603 - SMD 0603 package [Product Link] <http://www.futureelectronics.com/en/technologies/semiconductors/optoelectronics/leds/Pages/9894312-LTST-C190GKT.aspx?CrossPart=HSMG-C190&IM=0> LilyPad 1206 - SMD1206 LilyPad package [Product Link] <http://www.futureelectronics.com/en/Technologies/Product.aspx?ProductID=IN150NGHARVATEKCORPORATION2049943&IM=0> 1206 - SMD1206 package [Product Link] <http://www.futureelectronics.com/en/technologies/semiconductors/optoelectronics/leds/Pages/8315665-LTST-C150KGKT.aspx?IM=0> 1206 Bottom Mount -SMD 1206 Bottom Mount [Product Link] <http://www.digikey.com/product-detail/en/lite-on-inc/LTST-C230KGKT/160-1456-1-ND/386854> SparkFun Products: Pro Mini 328 -5V <https://www.sparkfun.com/products/821> RedBoard <https://www.sparkfun.com/products/12757> MP3 Trigger <https://www.sparkfun.com/products/13720> Makey Makey <https://www.sparkfun.com/products/11076>; PROD_ID: DIO-00821
E5_EXTRA_PINS = SparkFun-Connectors:CONN_15: Multi connection point. Often used as Generic Header-pin footprint for 0.1 inch spaced/style header connections On any of the 0.1 inch spaced packages, you can populate with these: Break Away Headers - Straight <https://www.sparkfun.com/products/116> (PRT-00116) Break Away Male Headers - Right Angle <https://www.sparkfun.com/products/553> (PRT-00553) Female Headers <https://www.sparkfun.com/products/115> (PRT-00115) Break Away Headers - Machine Pin <https://www.sparkfun.com/products/117> (PRT-00117) Break Away Female Headers - Swiss Machine Pin <https://www.sparkfun.com/products/743> (PRT-00743) For SCREWTERMINALS and SPRING TERMINALS visit here: Screw Terimnals on SparkFun.com <https://www.sparkfun.com/search/results?term=Screw+Terminals> (5mm/3.5mm/2.54mm spacing) This device is also useful as a general connection point to wire up your design to another part of your project. Our various solder wires solder well into these plated through hole pads. Hook-Up Wire - Assortment (Stranded, 22 AWG) <https://www.sparkfun.com/products/11375> (PRT-11375) Hook-Up Wire - Assortment (Solid Core, 22 AWG) <https://www.sparkfun.com/products/11367> (PRT-11367) View the entire wire category on our website here <https://www.sparkfun.com/categories/141> Special notes: Molex polarized connector foot print use with SKU : PRT-08231 with associated crimp pins and housings. 1MM SMD Version SKU: PRT-10208 NOTES ON THE VARIANTS LOCK and LOCK_LONGPADS... This footprint was designed to help hold the alignment of a through-hole component (i.e. 6-pin header) while soldering it into place. You may notice that each hole has been shifted either up or down by 0.005 of an inch from it's more standard position (which is a perfectly straight line). This slight alteration caused the pins (the squares in the middle) to touch the edges of the holes. Because they are alternating, it causes a "brace" to hold the component in place. 0.005 has proven to be the perfect amount of "off-center" position when using our standard breakaway headers. Although looks a little odd when you look at the bare footprint, once you have a header in there, the alteration is very hard to notice. Also,if you push a header all the way into place, it is covered up entirely on the bottom side.
E5_SWO MM_SWO = SparkFun-Connectors:CORTEX_JTAG_DEBUG_MINIMUM: Cortex Debug Connector - 10 pin Supports JTAG debug, Serial Wire debug, and Serial Wire Viewer. PTH and SMD connector options available. General Connector Information <http://infocenter.arm.com/help/topic/com.arm.doc.faqs/attached/13634/cortex_debug_connectors.pdf> Products: PTH Connector <http://www.digikey.com/product-detail/en/cnc-tech/3220-10-0100-00/1175-1627-ND/3883661> -via Digi-Key SparkFun PSoc <https://www.sparkfun.com/products/13229> SparkFun T <https://www.sparkfun.com/products/13810>
F1 = Circuit-Protection:FUSE: Fuse - Generic; CATEGORY: Circuit-Protection; SUB-CATEGORY: Fuse
FB1 = SparkFun-Coils:FERRITE_BEAD: Ferrite Bead (blocks, cores, rings, chokes, etc.) Inductor with layers of ferrite used to suppress high frequencies. Often used to isolate high frequency noise. SparkFun Products: IOIO-OTG - V2.2 <https://www.sparkfun.com/products/13613> SparkFun SAMD21 Mini Breakout <https://www.sparkfun.com/products/13664> SparkFun 6 Degrees of Freedom Breakout - LSM6DS3 <https://www.sparkfun.com/products/13339> SparkFun SAMD21 Dev Breakout <https://www.sparkfun.com/products/13672>; PROD_ID: NDUC-07859; VALUE: 30Ω/1.8A
H5 = SparkFun-Hardware:STAND-OFF-REFLOW: Stand Off Reflow Compatible A metal standoff that can be placed and reflowed onto a PCB.; PROD_ID: HW-14899
J2 = ST-TF-003A:ST-TF-003A: Micro SD Card Socket; MANUFACTURER: Suntech; MPN: ST-TF-003A
J3 = SparkFun-RF:XBEE: Digi XBee and XBee Pro XBees are tiny blue chips that can communicate wirelessly with each other. They can do simple things, like replacing a couple of wires in serial communication, which is nice when you want to make a remote for your paintball vehicle. SparkFun Products SparkFun XBee Buying Guide <https://www.sparkfun.com/pages/xbee_guide> SparkFun XBee Explorer USB <https://www.sparkfun.com/products/11812> (WRL-11812) Breakout Board for XBee Module <https://www.sparkfun.com/products/8276> (WRL-8276) SparkFun XBee Explorer Regulated <https://www.sparkfun.com/products/11373> (WRL-11373) SparkFun XBee Explorer Dongle <https://www.sparkfun.com/products/11697> (WRL-11697) SparkFun XBee Shield <https://www.sparkfun.com/products/12847> (WRL-12847) SparkFun XBee Explorer Serial <https://www.sparkfun.com/products/13225> (WRL-13225); PROD_ID: CONN-09042
J4 J15 = JST SH Connectors:BM05B-SRSS-TB(LF)(SN): Check availability <https://pricing.snapeda.com/parts/BM05B-SRSS-TB%28LF%29%28SN%29/JST%20Sales/view-part?ref=eda>; AVAILABILITY: In Stock; DESCRIPTION: Connector Header Surface Mount 5 position 0.039 (1.00mm); MF: JST Sales; MP: BM05B-SRSS-TB(LF)(SN); MPN: BM06B-SRSS-TB(LF)(SN); PACKAGE: None; PRICE: None; PURCHASE-URL: https://pricing.snapeda.com/search?q=BM05B-SRSS-TB(LF)(SN)&ref=eda
J5 J10 J11 = JST SH Connectors:BM04B-SRSS-TB(LF)(SN): Check availability <https://pricing.snapeda.com/parts/BM04B-SRSS-TB%28LF%29%28SN%29/JST%20Sales/view-part?ref=eda>; AVAILABILITY: In Stock; DESCRIPTION: Connector Header Surface Mount 4 position 0.039 (1.00mm); MF: JST Sales; MP: BM04B-SRSS-TB(LF)(SN); MPN: BM04B-SRSS-TB(LF)(SN); PACKAGE: None; PRICE: None; PURCHASE-URL: https://pricing.snapeda.com/search?q=BM04B-SRSS-TB(LF)(SN)&ref=eda
J6 = adafruit:JST_2PIN: JST 2-Pin Connectors of various flavors SMT-RA (S2B-PH-SM4) 4UConnector #17311 SMT (B2B-PH-SM4) THM-RA (S2B-PH) THM (B2B-PH); MPN: S2B-PH-SM4-TB(LF)(SN)
J7 = SparkFun-MicroMod:MICROMOD: MicroMod Connector Description: A card edge connector and mating PCB connector to allow various MicroMod Processor Boards to be coupled with various carrier boards of different capabilities. Based on the M.2 standard.; MPN: 2199230-4; PROD_ID: CONN-14877
J8 = SparkFun-Connectors:CONN_02: Multi connection point. Often used as Generic Header-pin footprint for 0.1 inch spaced/style header connections On any of the 0.1 inch spaced packages, you can populate with these: Break Away Headers - Straight <https://www.sparkfun.com/products/116> (PRT-00116) Break Away Male Headers - Right Angle <https://www.sparkfun.com/products/553> (PRT-00553) Female Headers <https://www.sparkfun.com/products/115> (PRT-00115) Break Away Headers - Machine Pin <https://www.sparkfun.com/products/117> (PRT-00117) Break Away Female Headers - Swiss Machine Pin <https://www.sparkfun.com/products/743> (PRT-00743) For SCREWTERMINALS and SPRING TERMINALS visit here: Screw Terimnals on SparkFun.com <https://www.sparkfun.com/search/results?term=Screw+Terminals> (5mm/3.5mm/2.54mm spacing) This device is also useful as a general connection point to wire up your design to another part of your project. Our various solder wires solder well into these plated through hole pads. Hook-Up Wire - Assortment (Stranded, 22 AWG) <https://www.sparkfun.com/products/11375> (PRT-11375) Hook-Up Wire - Assortment (Solid Core, 22 AWG) <https://www.sparkfun.com/products/11367> (PRT-11367) View the entire wire category on our website here <https://www.sparkfun.com/categories/141> Special notes: Molex polarized connector foot print use with: PRT-08233 with associated crimp pins and housings. 2.54_SCREWTERM for use with PRT-10571. 3.5mm Screw Terminal footprints for PRT-08084 5mm Screw Terminal footprints for use with PRT-08432; PROD_ID: CONN-11443
J9 = SparkFun-Connectors:USB_C: USB Type C 16Pin Connector Super Speed pins not available on the 16-pin purely SMD connector so this part is best for USB 2.0 implementations. D1 and D2 are tied together enabling D+/- no matter which way the cable is plugged into the connector. The two channel configuration pins (CC1/2) are exposed. These are normally connected to ground via 5.1k resistors but can be reconfigured for high current/high power applications.; PROD_ID: CONN-14122
J12 = BAIT-Components:L203011MS02QE; COPYRIGHT: Copyright (C) 2023 Ultra Librarian. All rights reserved.; MANUFACTURER_PART_NUMBER: L203011MS02QE; MFR_NAME: C&K Components
J13 = SparkFun-Connectors:CONN_01: Single connection point. Often used as Generic Header-pin footprint for 0.1 inch spaced/style header connections On any of the 0.1 inch spaced packages, you can populate with these: Break Away Headers - Straight <https://www.sparkfun.com/products/116> (PRT-00116) Break Away Male Headers - Right Angle <https://www.sparkfun.com/products/553> (PRT-00553) Female Headers <https://www.sparkfun.com/products/115> (PRT-00115) Break Away Headers - Machine Pin <https://www.sparkfun.com/products/117> (PRT-00117) Break Away Female Headers - Swiss Machine Pin <https://www.sparkfun.com/products/743> (PRT-00743) This device is also useful as a general connection point to wire up your design to another part of your project. Our various solder wires solder well into these plated through hole pads. Hook-Up Wire - Assortment (Stranded, 22 AWG) <https://www.sparkfun.com/products/11375> (PRT-11375) Hook-Up Wire - Assortment (Solid Core, 22 AWG) <https://www.sparkfun.com/products/11367> (PRT-11367) View the entire wire category on our website here <https://www.sparkfun.com/categories/141> Special notes: SMTSO-256-ET is a "flush mount" nut for a 4-40 screw. We mostly use this on specialty testbeds; it is a nice way to connect hardware to your PCB at an adjustable hieght. Also note, the SNAP packages are for using a snappable style connector. We sell a baggie of snaps and they are also used on two LilyPad designs: Snap Assortment - 30 pack (male and female) <https://www.sparkfun.com/products/11347> (DEV-11347) LilyPad Arduino SimpleSnap <https://www.sparkfun.com/products/10941> (DEV-10941) LilyPad SimpleSnap Protoboard <https://www.sparkfun.com/products/10940> (DEV-10940)
J14 = BAIT-Components:SJ-3551B-MSMT-TR-67: 3.5 mm, Stereo, Right Angle, Mid Mount (SMT), 4 Conductors, 1 Internal Switch, Audio Jack Connector, IP67; MANUFACTURER: CUI Devices; MAXIMUM_PACKAGE_HEIGHT: 3.2 mm; PARTREV: 1.02; STANDARD: Manufacturer Recommendations
JP1 JP5 = microbuilder:HEADER-1X1: PIN HEADER
LINEIN LINEOUT = SparkFun-Connectors:CONN_03: Multi connection point. Often used as Generic Header-pin footprint for 0.1 inch spaced/style header connections On any of the 0.1 inch spaced packages, you can populate with these: Break Away Headers - Straight <https://www.sparkfun.com/products/116> (PRT-00116) Break Away Male Headers - Right Angle <https://www.sparkfun.com/products/553> (PRT-00553) Female Headers <https://www.sparkfun.com/products/115> (PRT-00115) Break Away Headers - Machine Pin <https://www.sparkfun.com/products/117> (PRT-00117) Break Away Female Headers - Swiss Machine Pin <https://www.sparkfun.com/products/743> (PRT-00743) Stackable Header - 3 Pin (Female, 0.1") <https://www.sparkfun.com/products/13875> (PRT-13875) For SCREWTERMINALS and SPRING TERMINALS visit here: Screw Terimnals on SparkFun.com <https://www.sparkfun.com/search/results?term=Screw+Terminals> (5mm/3.5mm/2.54mm spacing) This device is also useful as a general connection point to wire up your design to another part of your project. Our various solder wires solder well into these plated through hole pads. Hook-Up Wire - Assortment (Stranded, 22 AWG) <https://www.sparkfun.com/products/11375> (PRT-11375) Hook-Up Wire - Assortment (Solid Core, 22 AWG) <https://www.sparkfun.com/products/11367> (PRT-11367) View the entire wire category on our website here <https://www.sparkfun.com/categories/141> Special notes: Molex polarized connector foot print use with SKU : PRT-08232 with associated crimp pins and housings.
MEAS2 = SparkFun-Jumpers:JUMPER-COMBO_2_NC_TRACE
MIC_3V3 MIC_GND QWIIC2_PU QWIIC_PU = SparkFun-Jumpers:JUMPER-SMT_3_2-NC_TRACE: Normally closed trace jumper (2 of 2 connections) This jumper has a trace between all three pads so they are normally closed (NC). Use a razor knife to open the connection(s). For best results follow the IPC guidelines for cutting traces: Cutout at least 0.063 mm (0.005 in). Remove all loose material to clean up the cut area. Seal the cut with an approved epoxy. Reapply solder to reclose the connection(s).
MK1 = Audio-Devices:ICS-43432: Low-Noise Microphone with I2S Digital Output Datasheet <https://invensense.tdk.com/wp-content/uploads/2015/02/ICS-43432_DS.pdf>; CATEGORY: Audio-Devices; DESCRIPTION: Low-Noise Microphone with I2 S Digital Output; MANUFACTURER: InvenSense; MPN: ICS-43432; OPERATING_TEMPERATURE: −40°C to +85°C; PART_STATUS: ACTIVE; ROHS_COMPLIANCE: RoHS Compliant; SUB-CATEGORY: Microphone; TYPE: MEMS
MK2 = SPH0645LM4H-B:SPH0645LM4H-B: Mic Mems Digital I2s Omni -26db Check availability <https://pricing.snapeda.com/parts/SPH0645LM4H-B/Knowles/view-part?ref=eda>; AVAILABILITY: In Stock; DESCRIPTION: 20 Hz ~ 10 kHz Digital, I²S Microphone MEMS (Silicon) 1.62 V ~ 3.6 V Omnidirectional (-26dB ±3dB @ 94dB SPL) Solder Pads; MF: Knowles; MP: SPH0645LM4H-B; MPN: SPH0645LM4H-B; PACKAGE: None; PRICE: None; PURCHASE-URL: https://pricing.snapeda.com/search/part/SPH0645LM4H-B/?ref=eda
POWER_PINS = SparkFun-Connectors:CONN_05: Multi connection point. Often used as Generic Header-pin footprint for 0.1 inch spaced/style header connections On any of the 0.1 inch spaced packages, you can populate with these: Break Away Headers - Straight <https://www.sparkfun.com/products/116> (PRT-00116) Break Away Male Headers - Right Angle <https://www.sparkfun.com/products/553> (PRT-00553) Female Headers <https://www.sparkfun.com/products/115> (PRT-00115) Break Away Headers - Machine Pin <https://www.sparkfun.com/products/117> (PRT-00117) Break Away Female Headers - Swiss Machine Pin <https://www.sparkfun.com/products/743> (PRT-00743) For SCREWTERMINALS and SPRING TERMINALS visit here: Screw Terimnals on SparkFun.com <https://www.sparkfun.com/search/results?term=Screw+Terminals> (5mm/3.5mm/2.54mm spacing) This device is also useful as a general connection point to wire up your design to another part of your project. Our various solder wires solder well into these plated through hole pads. Hook-Up Wire - Assortment (Stranded, 22 AWG) <https://www.sparkfun.com/products/11375> (PRT-11375) Hook-Up Wire - Assortment (Solid Core, 22 AWG) <https://www.sparkfun.com/products/11367> (PRT-11367) View the entire wire category on our website here <https://www.sparkfun.com/categories/141> Special notes: Molex polarized connector foot print use with SKU : PRT-08231 with associated crimp pins and housings. 1MM SMD Version SKU: PRT-10208
R1 R18-R21 R36 = OPL_Resistor:SMD-RES-100K-1%-1/10W(0603): 301010196; MPN: RC0603FR-07100KL
R2 R3 R16 R34 R35 = OPL_Resistor:SMD-RES-2.2K-5%-1/10W(0603): 301010124; MPN: RC0603JR-072K2L
R4 R14 R15 = OPL_Resistor:SMD-RES-0R-5%-1/10W(0603): 301011974; MPN: RC0603JR-070RL
R5 R11 R24 = OPL_Resistor:SMD-RES-4.7K-5%-1/10W(0603): 301010290; MPN: RC0603JR-074K7L
R6-R8 R23 R40 = OPL_Resistor:SMD-RES-1K-5%-1/10W(0603): 301010291; MPN: RC0603JR-071KL
R9 R38 R41-R44 = OPL_Resistor:SMD-RES-10K-5%-1/10W(0603): 301010293; MPN: RC0603JR-0710KL
R10 = OPL_Resistor:SMD-RES-20K-1%-1/10W(0603): 301011971; MPN: RC0603FR-0720KL
R12 R13 = SparkFun-Resistors:5.1KOHM; PROD_ID: RES-12083
R17 = SparkFun-Resistors:RESISTOR: Resistor Basic schematic elements and footprints for 0603, 1206, and PTH resistors.; MPN: LR1206-21R010J4; PROD_ID: RES-13218
R22 R25 = OPL_Resistor:SMD-RES-100K-1%-1/10W(0603): 301010196; MPN: RC0603FR-07100KL; VALUE: 100K
R26 = OPL_Resistor:SMD-RES-100K-1%-1/10W(0603): 301010196; MPN: ERA-3AEB1153V; VALUE: 100K
R27-R29 = SparkFun-Resistors:RESISTOR: Generic Resistor Package
R32 = OPL_Resistor:SMD-RES-3.3K-1%-1/10W(0603): 301012069; MPN: RC0603FR-073K3L
R39 = OPL_Resistor:SMD-RES-560R-5%-1/10W(0603): 301012137; MPN: RC0603FR-07590RL; VALUE: 1.5K
SW1-SW3 = OPL_Switch:SMD-BUTTON(4P-5.2X5.2X1.5MM-SKQGADE010): 311020017; MPN: SKQGADE010
TH1-TH4 = NTCG163JX103DT1S:NTCG163JX103DT1S; MANUFACTURER: TDK; MAXIMUM_PACKAGE_HEIGHT: 0.9 mm; MPN: NTCG163JX103DT1S; PARTREV: 8/12/2022; STANDARD: Manufacturer Recommendations
TP1 TP3 = testpad:PTR1: TEST PIN
TP2 = Discrete-new:TEST-POINT; PARTNO: DNP
U1 = Freescale:SGTL5000-32; MPN: SGTL5000XNAA3; URL: https://www.futureelectronics.com/p/4079583
U2 = 2022-08-05_10-01-44_Library:AP7313; MPN: AP7313-18SAG-7; URL: https://www.digikey.com/en/products/detail/diodes-incorporated/AP7313-18SAG-7/2270804
U3 U11 U12 = SparkFun-IC-Power:V_REG_AP2112: AP2112 - 600mA CMOS LDO Regulator w/ Enable The AP2112 is CMOS process low dropout linear regulator with enable function, the regulator delivers a guaranteed 600mA (min.) continuous load current. Features Output Voltage Accuracy: ±1.5% Output Current: 600mA (Min.) Foldback Short Current Protection: 50mA Enable Function to Turn ON/OFF VOUT Low Dropout Voltage (3.3V): 250mV (Typ.) @IOUT=600mA Excellent Load Regulation: 0.2%/A (Typ.) Excellent Line Regulation: 0.02%/V (Typ.) Low Quiescent Current: 55μA (Typ.) Low Standby Current: 0.01μA (Typ.) Low Output Noise: 50μVRMS PSRR: 100Hz -65dB, 1kHz -65dB OTSD Protection Stable with 1.0μF Flexible Cap: Ceramic, Tantalum and Aluminum Electrolytic Operation Temperature Range: -40°C to 85°C ESD: MM 400V, HBM 4000V; PROD_ID: VREG-12457
U4 = SparkFun-IC-Power:V_REG_AP2112: AP2112 - 600mA CMOS LDO Regulator w/ Enable The AP2112 is CMOS process low dropout linear regulator with enable function, the regulator delivers a guaranteed 600mA (min.) continuous load current. Features Output Voltage Accuracy: ±1.5% Output Current: 600mA (Min.) Foldback Short Current Protection: 50mA Enable Function to Turn ON/OFF VOUT Low Dropout Voltage (3.3V): 250mV (Typ.) @IOUT=600mA Excellent Load Regulation: 0.2%/A (Typ.) Excellent Line Regulation: 0.02%/V (Typ.) Low Quiescent Current: 55μA (Typ.) Low Standby Current: 0.01μA (Typ.) Low Output Noise: 50μVRMS PSRR: 100Hz -65dB, 1kHz -65dB OTSD Protection Stable with 1.0μF Flexible Cap: Ceramic, Tantalum and Aluminum Electrolytic Operation Temperature Range: -40°C to 85°C ESD: MM 400V, HBM 4000V; MPN: AP2112K-3.3TRG1; PROD_ID: VREG-12457
U5 = SparkFun-PowerIC:BQ27441-G1: Texas Instruments BQ27441-G1 LiPo Battery Fuel Gauge The Texas Instruments bq27441-G1 fuel gauge is a microcontroller peripheral that provides system-side fuel gauging for single-cell Li-Ion batteries. The device requires minimal user configuration and system microcontroller firmware development. The bq27441-G1 battery fuel gauge uses the patented Impedance Track™ algorithm for fuel gauging, and provides information such as remaining battery capacity (mAh), state-of-charge (%), and battery voltage (mV). Datasheet <http://www.ti.com/product/BQ27441-G1/datasheet> SparkFun Products SparkFun Battery Babysitter <https://www.sparkfun.com/products/13777> (PRT-13777); MPN: BQ27441DRZT-G1A; PROD_ID: IC-13220
U6 = adafruit_power:BQ24074; MPN: BQ24074RGTR
U7 = moudle-new:MOUDLE_LORA_E5; MPN: 317990687
U8 = Ablic:S-1172B33-E6T1U; COPYRIGHT: Copyright (C) 2022 Ultra Librarian. All rights reserved.; DIGI-KEY_PART_NUMBER_1: 1662-1407-2-ND; DIGI-KEY_PART_NUMBER_2: 1662-1407-1-ND; DIGI-KEY_PART_NUMBER_3: 1662-1407-6-ND; MANUFACTURER_PART_NUMBER: S-1172B33-E6T1U; MFR_NAME: ABLIC; MPN: 1662-1407-2-ND
U9 = Bosch Tools - BME680:BOSCH_TOOLS_BME680: Pressure, Temperature and Humidity Sensor Digital Output 1.8V 8-Pin LGA; ACCURACY: 3%; AUTOMOTIVE: No; CENTROID_NOT_SPECIFIED: No; DATASHEET: https://ae-bst.resource.bosch.com/media/_tech/media/datasheets/BST-BME680-DS001.pdf; DEVICE_CLASS_L1: Sensors; DEVICE_CLASS_L2: Temperature and Humidity Sensors; DEVICE_CLASS_L3: unset; DIGIKEY_DESCRIPTION: SENSOR RH PRESSURE TEMP VOC; DIGIKEY_PART_NUMBER: 828-1077-1-ND; FOOTPRINT_VARIANT_NAME_0: Recommended_Land_Pattern; HEIGHT: 1mm; INTERFACE: I2C,SPI; LEAD_FREE: Yes; MAX_SUPPLY_VOLTAGE: 3.6V; MF: Bosch Tools; MFG_PACKAGE_IDENT: 0; MFG_PACKAGE_IDENT_DATE: 0; MFG_PACKAGE_IDENT_REV: 0; MIN_SUPPLY_VOLTAGE: 1.2V; MOUSER_DESCRIPTION: Pressure, Temperature and Humidity Sensor Digital Output 1.8V 8-Pin LGA; MOUSER_PART_NUMBER: 262-BME680; MPN: BME680; OPERATING_SUPPLY_CURRENT: 0.09-12mA; PACKAGE: LGA8; PIN_0_0_3_INSIDE_EDGE: clock; PREFIX: U; ROHS: Yes; SENSOR_OUTPUT: I2C,SPI; TEMPERATURE_RANGE_HIGH: +85°C; TEMPERATURE_RANGE_LOW: -40°C; VERIFICATION_VERSION: 0.0.0.3
U10 = 2023-02-07_20-42-29_Library:TSL25911FN; COPYRIGHT: Copyright (C) 2023 Ultra Librarian. All rights reserved.; DIGI-KEY_PART_NUMBER_1: TSL25911FNTR-ND; DIGI-KEY_PART_NUMBER_2: TSL25911FNCT-ND; DIGI-KEY_PART_NUMBER_3: TSL25911FNDKR-ND; MANUFACTURER_PART_NUMBER: TSL25911FN; MFR_NAME: ams OSRAM; MPN: TSL25911FN
U13 = BAIT-Components:LTC2956IMS-1PBF; COPYRIGHT: Copyright (C) 2023 Ultra Librarian. All rights reserved.; MANUFACTURER_PART_NUMBER: LTC2956IMS-1#PBF; MFR_NAME: Analog Devices Inc
XB_EXTRA_PINS = SparkFun-Connectors:CONN_02: Multi connection point. Often used as Generic Header-pin footprint for 0.1 inch spaced/style header connections On any of the 0.1 inch spaced packages, you can populate with these: Break Away Headers - Straight <https://www.sparkfun.com/products/116> (PRT-00116) Break Away Male Headers - Right Angle <https://www.sparkfun.com/products/553> (PRT-00553) Female Headers <https://www.sparkfun.com/products/115> (PRT-00115) Break Away Headers - Machine Pin <https://www.sparkfun.com/products/117> (PRT-00117) Break Away Female Headers - Swiss Machine Pin <https://www.sparkfun.com/products/743> (PRT-00743) For SCREWTERMINALS and SPRING TERMINALS visit here: Screw Terimnals on SparkFun.com <https://www.sparkfun.com/search/results?term=Screw+Terminals> (5mm/3.5mm/2.54mm spacing) This device is also useful as a general connection point to wire up your design to another part of your project. Our various solder wires solder well into these plated through hole pads. Hook-Up Wire - Assortment (Stranded, 22 AWG) <https://www.sparkfun.com/products/11375> (PRT-11375) Hook-Up Wire - Assortment (Solid Core, 22 AWG) <https://www.sparkfun.com/products/11367> (PRT-11367) View the entire wire category on our website here <https://www.sparkfun.com/categories/141> Special notes: Molex polarized connector foot print use with: PRT-08233 with associated crimp pins and housings. 2.54_SCREWTERM for use with PRT-10571. 3.5mm Screw Terminal footprints for PRT-08084 5mm Screw Terminal footprints for use with PRT-08432

## Net classes
0 default: width 0 mm, drill 0 mm